# Altium schematic sheet CONNECTORS_WIRES.SchDoc
size A4; SheetNumber: 10; SheetTotal: 12
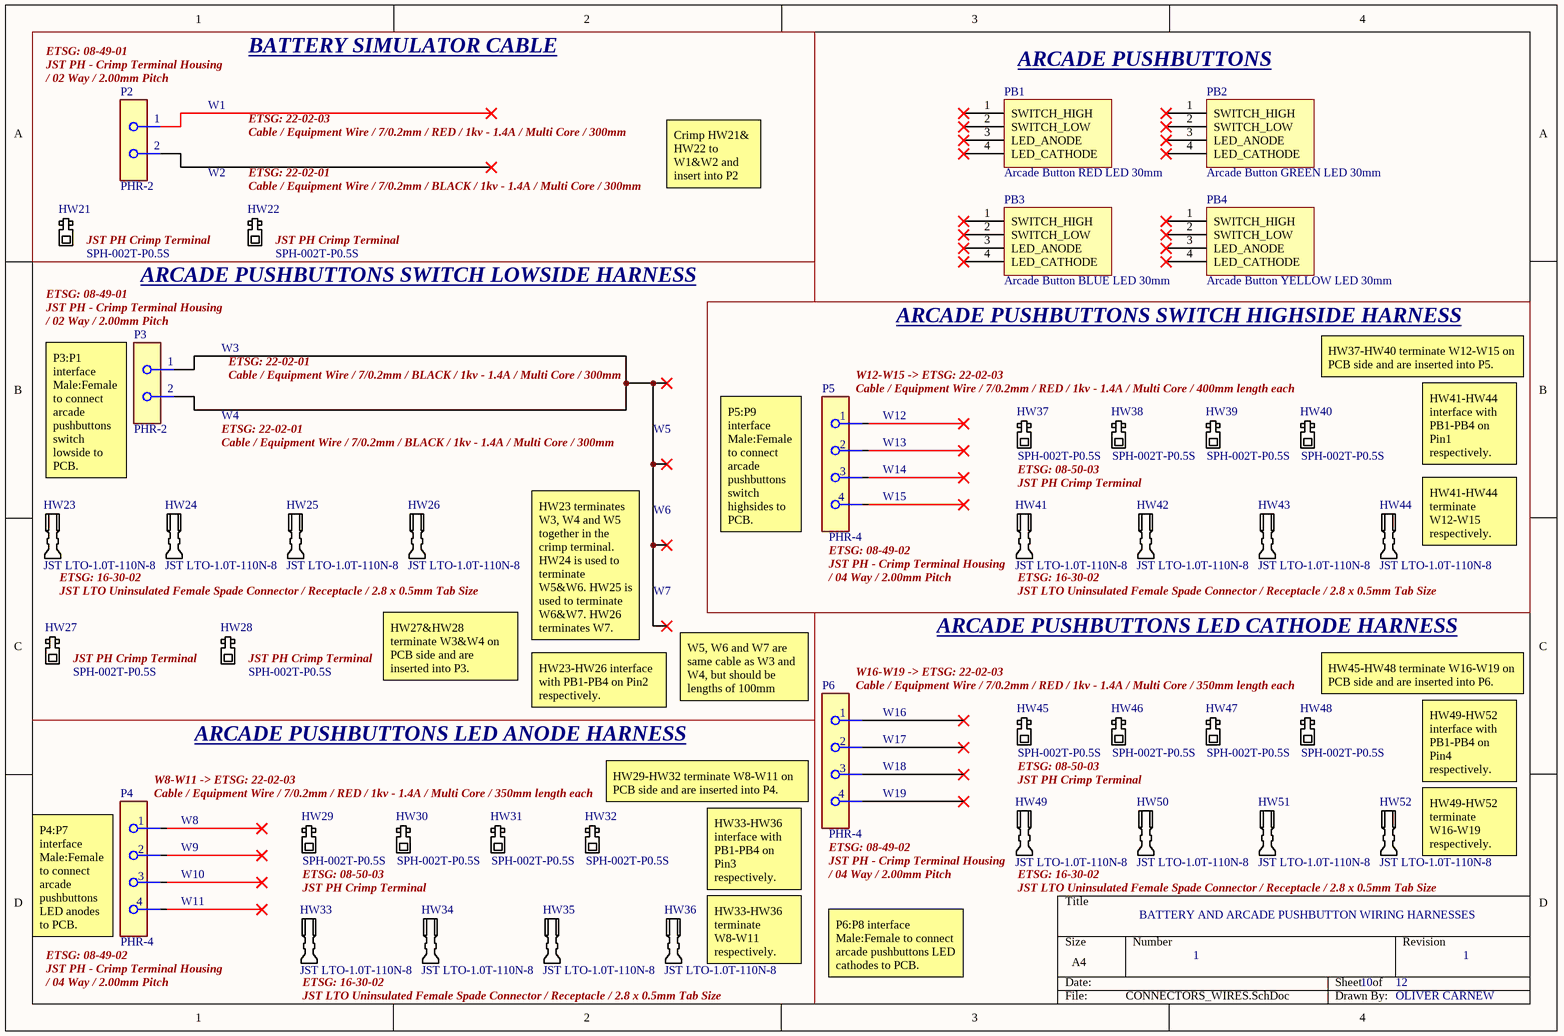
[diagram p0: CONNECTORS_WIRES.SchDoc]

## Parts
HW21  SPH-002T-P0.5S
HW22  SPH-002T-P0.5S
HW23  JST LTO-1.0T-110N-8
HW24  JST LTO-1.0T-110N-8
HW25  JST LTO-1.0T-110N-8
HW26  JST LTO-1.0T-110N-8
HW27  SPH-002T-P0.5S
HW28  SPH-002T-P0.5S
HW29  SPH-002T-P0.5S
HW30  SPH-002T-P0.5S
HW31  SPH-002T-P0.5S
HW32  SPH-002T-P0.5S
HW33  JST LTO-1.0T-110N-8
HW34  JST LTO-1.0T-110N-8
HW35  JST LTO-1.0T-110N-8
HW36  JST LTO-1.0T-110N-8
HW37  SPH-002T-P0.5S
HW38  SPH-002T-P0.5S
HW39  SPH-002T-P0.5S
HW40  SPH-002T-P0.5S
HW41  JST LTO-1.0T-110N-8
HW42  JST LTO-1.0T-110N-8
HW43  JST LTO-1.0T-110N-8
HW44  JST LTO-1.0T-110N-8
HW45  SPH-002T-P0.5S
HW46  SPH-002T-P0.5S
HW47  SPH-002T-P0.5S
HW48  SPH-002T-P0.5S
HW49  JST LTO-1.0T-110N-8
HW50  JST LTO-1.0T-110N-8
HW51  JST LTO-1.0T-110N-8
HW52  JST LTO-1.0T-110N-8
P2  PHR-2  [FP-PHR-2-MFG]
P3  PHR-2  [FP-PHR-2-MFG]
P4  PHR-4  [FP-PHR-4-MFG]
P5  PHR-4  [FP-PHR-4-MFG]
P6  PHR-4  [FP-PHR-4-MFG]
PB1  Arcade Button RED LED 30mm
PB2  Arcade Button GREEN LED 30mm
PB3  Arcade Button BLUE LED 30mm
PB4  Arcade Button YELLOW LED 30mm

## Blocks framed on the sheet
BATTERY SIMULATOR CABLE: HW21 HW22 P2
ARCADE PUSHBUTTONS SWITCH HIGHSIDE HARNESS: HW37-HW44 P5

## Nets

Not connected (* = marked no-connect by the designer): PB1 1(SWITCH_HIGH)* 2(SWITCH_LOW)* 3(LED_ANODE)* 4(LED_CATHODE)*; PB2 1(SWITCH_HIGH)* 2(SWITCH_LOW)* 3(LED_ANODE)* 4(LED_CATHODE)*; PB3 1(SWITCH_HIGH)* 2(SWITCH_LOW)* 3(LED_ANODE)* 4(LED_CATHODE)*; PB4 1(SWITCH_HIGH)* 2(SWITCH_LOW)* 3(LED_ANODE)* 4(LED_CATHODE)*

## Notes on the sheet
- ETSG: 08-49-01
- JST PH - Crimp Terminal Housing
- / 02 Way / 2.00mm Pitch
- W1
- ARCADE PUSHBUTTONS
- (near P2) 1
- (near P2) 2
- W2
- ETSG: 22-02-03
- Cable / Equipment Wire / 7/0.2mm / RED / 1kv - 1.4A / Multi Core / 300mm
- (near HW22) ETSG: 22-02-01
- JST PH Crimp Terminal
- (near HW22) Cable / Equipment Wire / 7/0.2mm / BLACK / 1kv - 1.4A / Multi Core / 300mm
- (near HW22) JST PH Crimp Terminal
- Crimp HW21& HW22 to  W1&W2 and insert into P2
- (near HW22) ARCADE PUSHBUTTONS SWITCH LOWSIDE HARNESS
- (near P3) 1
- W3
- ETSG: 22-02-01
- Cable / Equipment Wire / 7/0.2mm / BLACK / 1kv - 1.4A / Multi Core / 300mm
- (near HW37) W12-W15 -> ETSG: 22-02-03
- (near HW40) HW37-HW40 terminate W12-W15 on PCB side and are inserted into P5.
- (near P3) 2
- W4
- W5
- Cable / Equipment Wire / 7/0.2mm / RED / 1kv - 1.4A / Multi Core / 400mm length each
- W12
- (near P5) W13
- (near P3) P3:P1 interface Male:Female to connect arcade pushbuttons switch lowside to PCB.
- W6
- (near P5) W14
- (near P5) W15
- ETSG: 08-50-03
- HW41-HW44 interface with PB1-PB4 on Pin1 respectively.
- ETSG: 16-30-02
- (near P5) P5:P9 interface Male:Female to connect arcade pushbuttons switch highsides to PCB.
- ETSG: 08-49-02
- (near HW41) JST PH - Crimp Terminal Housing
- (near HW41) / 04 Way / 2.00mm Pitch
- (near HW41) ETSG: 16-30-02
- (near HW44) HW41-HW44 terminate W12-W15 respectively.
- JST LTO Uninsulated Female Spade Connector / Receptacle / 2.8 x 0.5mm Tab Size
- HW23 terminates W3, W4 and W5 together in the crimp terminal. HW24 is used to terminate W5&W6. HW25 is used to terminate W6&W7. HW26 terminates W7.
- W7
- ARCADE PUSHBUTTONS LED CATHODE HARNESS
- (near HW28) JST PH Crimp Terminal
- HW27&HW28 terminate W3&W4 on PCB side and are inserted into P3.
- HW23-HW26 interface with PB1-PB4 on Pin2 respectively.
- W5, W6 and W7 are same cable as W3 and W4, but should be lengths of 100mm
- (near HW45) W16-W19 -> ETSG: 22-02-03
- Cable / Equipment Wire / 7/0.2mm / RED / 1kv - 1.4A / Multi Core / 350mm length each
- W16
- (near HW48) HW45-HW48 terminate W16-W19 on PCB side and are inserted into P6.
- (near HW29) W8-W11 -> ETSG: 22-02-03
- ARCADE PUSHBUTTONS LED ANODE HARNESS
- (near P6) W17
- (near P6) W18
- HW49-HW52 interface with PB1-PB4 on Pin4 respectively.
- W8
- (near P4) W9
- HW29-HW32 terminate W8-W11 on PCB side and are inserted into P4.
- (near P6) W19
- (near HW52) HW49-HW52 terminate W16-W19 respectively.
- (near P4) W10
- (near P4) W11
- HW33-HW36 interface with PB1-PB4 on Pin3 respectively.
- (near HW49) JST PH - Crimp Terminal Housing
- (near HW49) / 04 Way / 2.00mm Pitch
- (near HW49) ETSG: 16-30-02
- BATTERY AND ARCADE PUSHBUTTON WIRING HARNESSES
- (near P4) P4:P7 interface Male:Female to connect arcade pushbuttons LED anodes to PCB.
- / 04 Way / 2.00mm Pitch
- (near HW33) ETSG: 16-30-02
- (near HW36) HW33-HW36 terminate W8-W11 respectively.
- P6:P8 interface Male:Female to connect arcade pushbuttons LED cathodes to PCB.
- 1
- 10
- 12
- OLIVER CARNEW
- (in symbol CMP-17439-000059-1) 2; 3

## Library data of the parts
HW23-HW26 HW33-HW36 HW41-HW44 HW49-HW52 = JST LTO-1.0T-110N-8: JST LTO Uninsulated Female Spade Connector / Receptacle / 2.8 x 0.5mm Tab Size
P2 P3 = CMP-17439-000064-1: CONN HOUSING PH 2POS 2MM WHITE; Wire Gauge (Min): 24AWG; Number of Positions: 2; Gender: Female; Working Voltage: 100V; Contact Resistance: 10mR; Connector Type: Receptacle; Wire Gauge (Max): 30AWG; Max Current Rating: 2A; Insulation Resistance: 1GR; REACH SVHC: No SVHC; Contact Plating: Tin; Contact Type: Female Socket; Housing Material: Polyamide; Height: 6.4mm; Weight: 0.0625lb; Pitch: 2mm; Number of Rows: 1; Number of Contacts: 2; Mount: Free Hanging; Color: Natural; Lead Free: Lead Free; Max Operating Temperature: 85°C; Min Operating Temperature: -25°C; Length: 5.8mm; Depth: 6.85mm; Termination: Crimp; Number of Pins: 2; Max Voltage Rating (AC): 100V; Contact Material: Bronze; Housing Color: White; Current Rating: 2A; Fastening Type: Detent; Width: 4.5mm; Packaging: Bulk; Orientation: Straight; Series: PH; Flammability Rating: UL94 V-0; Material: Nylon
P4-P6 = CMP-17439-000059-1: CONN HOUSING PH 4POS 2MM WHITE; Insulation Resistance: 1GR; Gender: Receptacle; Contact Resistance: 10mR; Number of Contacts: 4; Working Voltage: 100V; Current Rating: 2A; Min Operating Temperature: -25°C; Flammability Rating: UL94 V-0; Pitch: 2mm; Contact Plating: Tin; Lead Free: Lead Free; Color: Natural; Depth: 6.85mm; Weight: 0.0625lb; Length: 9.8mm; Height: 6.4mm; Housing Material: Nylon; REACH SVHC: No SVHC; Termination: Crimp; Series: PH; Housing Color: Natural; Connector Type: Receptacle; Number of Rows: 1; Contact Type: Female Socket; Number of Positions: 4; Fastening Type: Detent; Width: 4.5mm; Packaging: Bulk; Orientation: Straight; Material: Nylon; Max Operating Temperature: 85°C; Number of Pins: 4; Contact Material: Bronze; Mount: Free Hanging
PB1-PB4 = ARCADE_PUSHBUTTON: Ausleaf.